# Altium schematic sheet USB Typec.SchDoc
size A3; DocumentNumber: 1; SheetNumber: 1; SheetTotal: 2
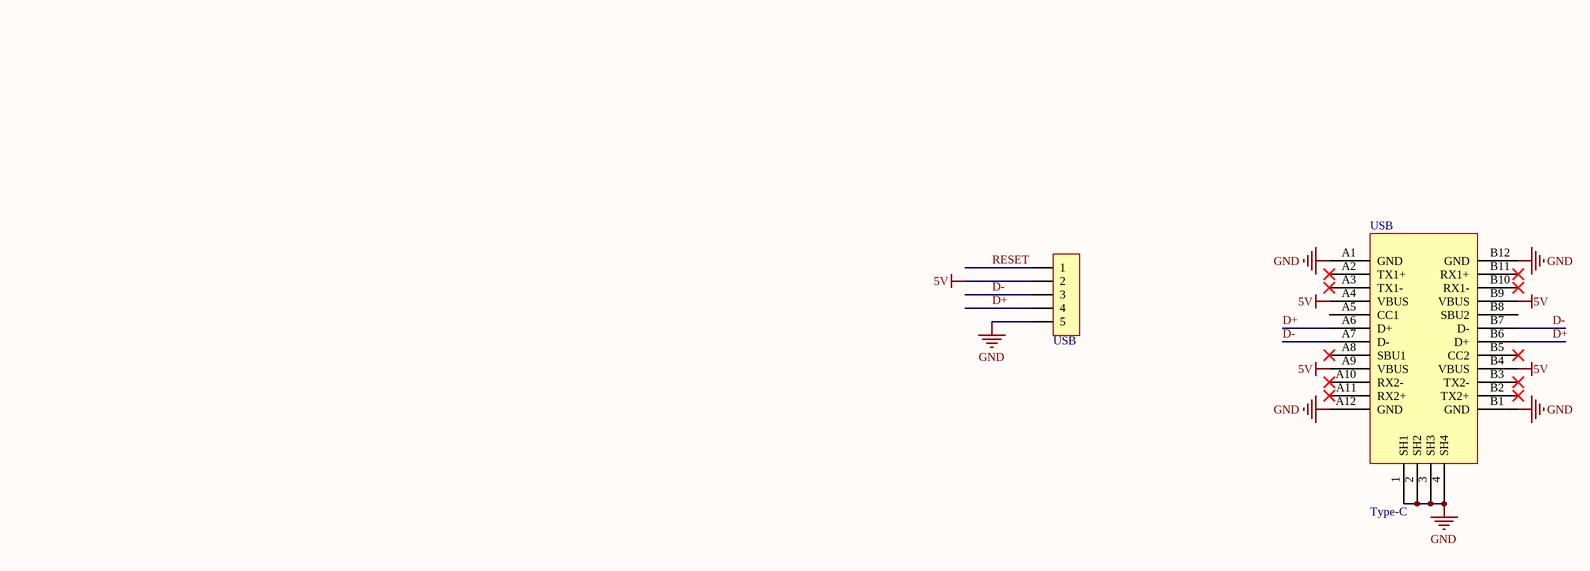
[diagram p0: USB Typec.SchDoc]

## Parts
(Parts that share a designator on the sheet are numbered #1, #2 ... from top to bottom, then left to right.)
USB#1  HDR-1X5  [ZH1.5-LS-5P]  (value not drawn)
USB#2  Type-C  [Type-C]

## Nets
5V: USB#1.2 USB#2.A4(VBUS) USB#2.A9(VBUS) USB#2.B4(VBUS) USB#2.B9(VBUS)
GND: USB#1.5 USB#2.1(SH1) USB#2.2(SH2) USB#2.3(SH3) USB#2.4(SH4) USB#2.A1(GND) USB#2.A12(GND) USB#2.B1(GND) USB#2.B12(GND)
D+: USB#1.4 USB#2.A6(D+) USB#2.B6(D+)
D-: USB#1.3 USB#2.A7(D-) USB#2.B7(D-)
RESET: USB#1.1

Not connected (* = marked no-connect by the designer): USB#2 A2(TX1+)* A3(TX1-)* A5(CC1) A8(SBU1)* A10(RX2-)* A11(RX2+)* B2(TX2+)* B3(TX2-)* B5(CC2)* B8(SBU2) B10(RX1-)* B11(RX1+)*

## Library data of the parts
USB#1 = Header 5: 5P接插件; 版权归属: 源创客; BOM名称: 5P接插件; 学习资源: www.ooocke.com